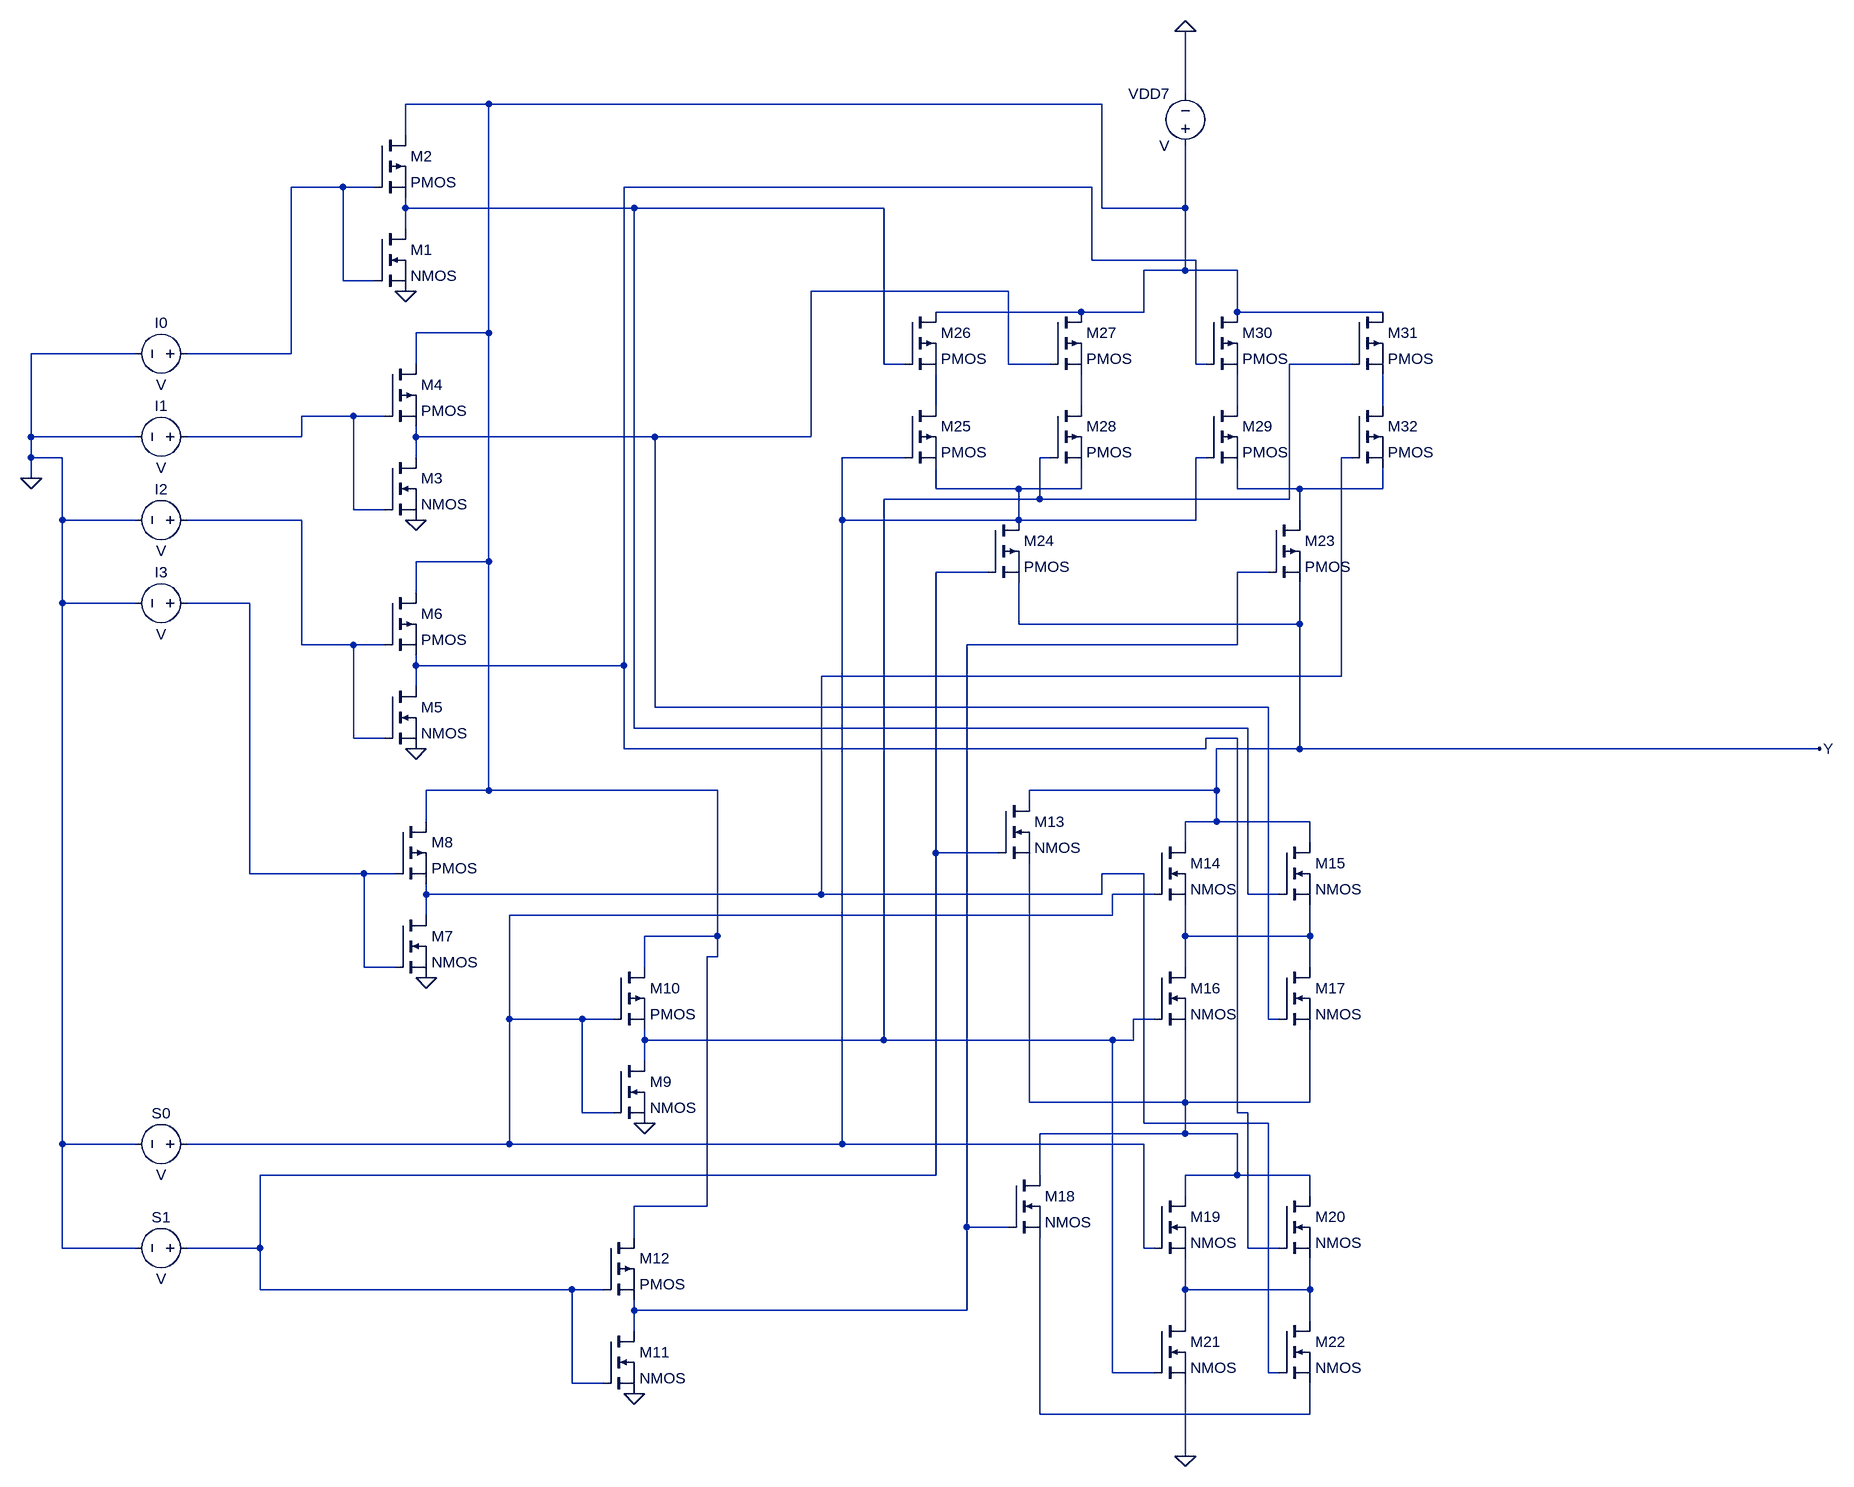
[diagram p0: schematic four to one MUX transistor level Schematic.asc]
four to one MUX transistor level Schematic.asc, the LTspice schematic file:
Version 4.1
SHEET 1 2592 1860
WIRE 1584 -256 1584 -352
WIRE 512 -240 384 -240
WIRE 1456 -240 512 -240
WIRE 384 -192 384 -240
WIRE 288 -112 208 -112
WIRE 336 -112 288 -112
WIRE 1440 -112 720 -112
WIRE 384 -80 384 -96
WIRE 736 -80 384 -80
WIRE 1120 -80 736 -80
WIRE 1456 -80 1456 -240
WIRE 1584 -80 1584 -176
WIRE 1584 -80 1456 -80
WIRE 384 -48 384 -80
WIRE 1440 0 1440 -112
WIRE 1600 0 1440 0
WIRE 1584 16 1584 -80
WIRE 1584 16 1520 16
WIRE 1664 16 1584 16
WIRE 288 32 288 -112
WIRE 336 32 288 32
WIRE 1312 48 1008 48
WIRE 1424 80 1200 80
WIRE 1520 80 1520 16
WIRE 1520 80 1424 80
WIRE 1664 80 1664 16
WIRE 1888 80 1664 80
WIRE 512 112 512 -240
WIRE 512 112 400 112
WIRE -32 144 -192 144
WIRE 208 144 208 -112
WIRE 208 144 48 144
WIRE 400 160 400 112
WIRE 1120 160 1120 -80
WIRE 1152 160 1120 160
WIRE 1312 160 1312 48
WIRE 1376 160 1312 160
WIRE 1600 160 1600 0
WIRE 1616 160 1600 160
WIRE 1840 160 1744 160
WIRE 1200 224 1200 176
WIRE 1424 224 1424 176
WIRE 1664 224 1664 176
WIRE 1888 224 1888 176
WIRE 304 240 224 240
WIRE 352 240 304 240
WIRE -192 272 -192 144
WIRE -32 272 -192 272
WIRE 224 272 224 240
WIRE 224 272 48 272
WIRE 400 272 400 256
WIRE 768 272 400 272
WIRE 1008 272 1008 48
WIRE 1008 272 768 272
WIRE -192 304 -192 272
WIRE -144 304 -192 304
WIRE 400 304 400 272
WIRE 1152 304 1056 304
WIRE 1376 304 1360 304
WIRE 1616 304 1600 304
WIRE 1840 304 1824 304
WIRE -192 336 -192 304
WIRE 1200 352 1200 320
WIRE 1328 352 1200 352
WIRE 1424 352 1424 320
WIRE 1424 352 1328 352
WIRE 1664 352 1664 320
WIRE 1760 352 1664 352
WIRE 1888 352 1888 320
WIRE 1888 352 1760 352
WIRE 1360 368 1360 304
WIRE 1360 368 1120 368
WIRE 1744 368 1744 160
WIRE 1744 368 1360 368
WIRE 304 384 304 240
WIRE 352 384 304 384
WIRE -144 400 -144 304
WIRE -32 400 -144 400
WIRE 224 400 48 400
WIRE 1056 400 1056 304
WIRE 1328 400 1328 352
WIRE 1328 400 1056 400
WIRE 1600 400 1600 304
WIRE 1600 400 1328 400
WIRE 1760 400 1760 352
WIRE 512 464 512 112
WIRE 512 464 400 464
WIRE 1280 480 1200 480
WIRE 1712 480 1664 480
WIRE 400 512 400 464
WIRE -144 528 -144 400
WIRE -32 528 -144 528
WIRE 144 528 48 528
WIRE 1328 560 1328 496
WIRE 1760 560 1760 496
WIRE 1760 560 1328 560
WIRE 224 592 224 400
WIRE 304 592 224 592
WIRE 352 592 304 592
WIRE 1664 592 1664 480
WIRE 1664 592 1248 592
WIRE 400 624 400 608
WIRE 720 624 720 -112
WIRE 720 624 400 624
WIRE 1824 640 1824 304
WIRE 1824 640 1024 640
WIRE 400 656 400 624
WIRE 768 688 768 272
WIRE 1712 688 768 688
WIRE 736 720 736 -80
WIRE 1680 720 736 720
WIRE 304 736 304 592
WIRE 352 736 304 736
WIRE 1664 736 1616 736
WIRE 720 752 720 624
WIRE 1616 752 1616 736
WIRE 1616 752 720 752
WIRE 1760 752 1760 560
WIRE 1760 752 1632 752
WIRE 2560 752 1760 752
WIRE 512 816 512 464
WIRE 512 816 416 816
WIRE 864 816 512 816
WIRE 1632 816 1632 752
WIRE 1632 816 1344 816
WIRE 1344 832 1344 816
WIRE 416 864 416 816
WIRE 1632 864 1632 816
WIRE 1632 864 1584 864
WIRE 1776 864 1632 864
WIRE 1584 896 1584 864
WIRE 1776 896 1776 864
WIRE 1200 912 1200 480
WIRE 1296 912 1200 912
WIRE 144 944 144 528
WIRE 320 944 144 944
WIRE 368 944 320 944
WIRE 1520 944 1456 944
WIRE 416 976 416 960
WIRE 1024 976 1024 640
WIRE 1024 976 416 976
WIRE 1456 976 1456 944
WIRE 1456 976 1024 976
WIRE 1536 976 1472 976
WIRE 1680 976 1680 720
WIRE 1728 976 1680 976
WIRE 416 1008 416 976
WIRE 1472 1008 1472 976
WIRE 1472 1008 544 1008
WIRE 864 1040 864 816
WIRE 864 1040 752 1040
WIRE 1584 1040 1584 992
WIRE 1776 1040 1776 992
WIRE 1776 1040 1584 1040
WIRE 864 1072 864 1040
WIRE 864 1072 848 1072
WIRE 320 1088 320 944
WIRE 368 1088 320 1088
WIRE 752 1088 752 1040
WIRE 1584 1088 1584 1040
WIRE 1776 1088 1776 1040
WIRE 544 1168 544 1008
WIRE 656 1168 544 1168
WIRE 704 1168 656 1168
WIRE 1536 1168 1504 1168
WIRE 1712 1168 1712 688
WIRE 1728 1168 1712 1168
WIRE 752 1200 752 1184
WIRE 1120 1200 1120 368
WIRE 1120 1200 752 1200
WIRE 1472 1200 1120 1200
WIRE 1504 1200 1504 1168
WIRE 1504 1200 1472 1200
WIRE 752 1232 752 1200
WIRE 1344 1296 1344 928
WIRE 1584 1296 1584 1184
WIRE 1584 1296 1344 1296
WIRE 1776 1296 1776 1184
WIRE 1776 1296 1584 1296
WIRE 656 1312 656 1168
WIRE 704 1312 656 1312
WIRE 1664 1312 1664 736
WIRE 1680 1312 1664 1312
WIRE 1520 1328 1520 944
WIRE 1712 1328 1520 1328
WIRE 1584 1344 1584 1296
WIRE 1584 1344 1360 1344
WIRE 1664 1344 1584 1344
WIRE -144 1360 -144 528
WIRE -32 1360 -144 1360
WIRE 544 1360 544 1168
WIRE 544 1360 48 1360
WIRE 1056 1360 1056 400
WIRE 1056 1360 544 1360
WIRE 1520 1360 1056 1360
WIRE 1200 1408 1200 912
WIRE 1200 1408 160 1408
WIRE 1360 1408 1360 1344
WIRE 1664 1408 1664 1344
WIRE 1664 1408 1584 1408
WIRE 1776 1408 1664 1408
WIRE 1584 1440 1584 1408
WIRE 1776 1440 1776 1408
WIRE 848 1456 848 1072
WIRE 848 1456 736 1456
WIRE 1248 1488 1248 592
WIRE 1312 1488 1248 1488
WIRE 736 1504 736 1456
WIRE -144 1520 -144 1360
WIRE -32 1520 -144 1520
WIRE 160 1520 160 1408
WIRE 160 1520 48 1520
WIRE 1520 1520 1520 1360
WIRE 1536 1520 1520 1520
WIRE 1680 1520 1680 1312
WIRE 1728 1520 1680 1520
WIRE 160 1584 160 1520
WIRE 640 1584 160 1584
WIRE 688 1584 640 1584
WIRE 1584 1584 1584 1536
WIRE 1776 1584 1776 1536
WIRE 1776 1584 1584 1584
WIRE 736 1616 736 1600
WIRE 1248 1616 1248 1488
WIRE 1248 1616 736 1616
WIRE 1584 1632 1584 1584
WIRE 1776 1632 1776 1584
WIRE 736 1648 736 1616
WIRE 1472 1712 1472 1200
WIRE 1536 1712 1472 1712
WIRE 1712 1712 1712 1328
WIRE 1728 1712 1712 1712
WIRE 640 1728 640 1584
WIRE 688 1728 640 1728
WIRE 1360 1776 1360 1504
WIRE 1776 1776 1776 1728
WIRE 1776 1776 1360 1776
WIRE 1584 1840 1584 1728
FLAG -192 336 0
FLAG 384 48 0
FLAG 400 400 0
FLAG 400 752 0
FLAG 416 1104 0
FLAG 752 1328 0
FLAG 736 1744 0
FLAG 2560 752 Y
FLAG 1584 1840 0
FLAG 1584 -352 0
SYMBOL voltage 64 144 R90
WINDOW 0 -32 56 VBottom 2
WINDOW 3 32 56 VTop 2
SYMATTR InstName I0
SYMBOL voltage 64 272 R90
WINDOW 0 -32 56 VBottom 2
WINDOW 3 32 56 VTop 2
SYMATTR InstName I1
SYMBOL voltage 64 400 R90
WINDOW 0 -32 56 VBottom 2
WINDOW 3 32 56 VTop 2
SYMATTR InstName I2
SYMBOL voltage 64 528 R90
WINDOW 0 -32 56 VBottom 2
WINDOW 3 32 56 VTop 2
SYMATTR InstName I3
SYMBOL nmos 336 -48 R0
SYMATTR InstName M1
SYMBOL pmos 336 -192 R0
SYMATTR InstName M2
SYMBOL nmos 352 304 R0
SYMATTR InstName M3
SYMBOL pmos 352 160 R0
SYMATTR InstName M4
SYMBOL nmos 352 656 R0
SYMATTR InstName M5
SYMBOL pmos 352 512 R0
SYMATTR InstName M6
SYMBOL nmos 368 1008 R0
SYMATTR InstName M7
SYMBOL pmos 368 864 R0
SYMATTR InstName M8
SYMBOL voltage 64 1360 R90
WINDOW 0 -32 56 VBottom 2
WINDOW 3 32 56 VTop 2
SYMATTR InstName S0
SYMBOL voltage 64 1520 R90
WINDOW 0 -32 56 VBottom 2
WINDOW 3 32 56 VTop 2
SYMATTR InstName S1
SYMBOL nmos 704 1232 R0
SYMATTR InstName M9
SYMBOL pmos 704 1088 R0
SYMATTR InstName M10
SYMBOL nmos 688 1648 R0
SYMATTR InstName M11
SYMBOL pmos 688 1504 R0
SYMATTR InstName M12
SYMBOL nmos 1296 832 R0
SYMATTR InstName M13
SYMBOL nmos 1536 896 R0
SYMATTR InstName M14
SYMBOL nmos 1728 896 R0
SYMATTR InstName M15
SYMBOL nmos 1536 1088 R0
SYMATTR InstName M16
SYMBOL nmos 1728 1088 R0
SYMATTR InstName M17
SYMBOL nmos 1312 1408 R0
SYMATTR InstName M18
SYMBOL nmos 1536 1440 R0
SYMATTR InstName M19
SYMBOL nmos 1728 1440 R0
SYMATTR InstName M20
SYMBOL nmos 1536 1632 R0
SYMATTR InstName M21
SYMBOL nmos 1728 1632 R0
SYMATTR InstName M22
SYMBOL pmos 1712 400 R0
SYMATTR InstName M23
SYMBOL pmos 1280 400 R0
SYMATTR InstName M24
SYMBOL pmos 1152 224 R0
SYMATTR InstName M25
SYMBOL pmos 1152 80 R0
SYMATTR InstName M26
SYMBOL pmos 1376 80 R0
SYMATTR InstName M27
SYMBOL pmos 1376 224 R0
SYMATTR InstName M28
SYMBOL pmos 1616 224 R0
SYMATTR InstName M29
SYMBOL pmos 1616 80 R0
SYMATTR InstName M30
SYMBOL pmos 1840 80 R0
SYMATTR InstName M31
SYMBOL pmos 1840 224 R0
SYMATTR InstName M32
SYMBOL voltage 1584 -160 R180
WINDOW 0 24 96 Left 2
WINDOW 3 24 16 Left 2
SYMATTR InstName VDD7

The netlist it stands for:
* four to one MUX transistor level Schematic.asc
V§I0 N002 0 V
V§I1 N011 0 V
V§I2 N015 0 V
V§I3 N018 0 V
M1 N004 N002 0 0 NMOS
M2 N001 N002 N004 N004 PMOS
M3 N005 N011 0 0 NMOS
M4 N001 N011 N005 N005 PMOS
M5 N003 N015 0 0 NMOS
M6 N001 N015 N003 N003 PMOS
M7 N013 N018 0 0 NMOS
M8 N001 N018 N013 N013 PMOS
V§S0 N012 0 V
V§S1 N016 0 V
M9 N006 N012 0 0 NMOS
M10 N001 N012 N006 N006 PMOS
M11 N017 N016 0 0 NMOS
M12 N001 N016 N017 N017 PMOS
M13 Y N016 N020 N020 NMOS
M14 Y N012 N019 N019 NMOS
M15 Y N004 N019 N019 NMOS
M16 N019 N006 N020 N020 NMOS
M17 N019 N005 N020 N020 NMOS
M18 N020 N017 N022 N022 NMOS
M19 N020 N012 N021 N021 NMOS
M20 N020 N003 N021 N021 NMOS
M21 N021 N006 0 0 NMOS
M22 N021 N013 N022 N022 NMOS
M23 N014 N017 Y Y PMOS
M24 N012 N016 Y Y PMOS
M25 N007 N012 N012 N012 PMOS
M26 N001 N004 N007 N007 PMOS
M27 N001 N005 N008 N008 PMOS
M28 N008 N006 N012 N012 PMOS
M29 N009 N012 N014 N014 PMOS
M30 N001 N003 N009 N009 PMOS
M31 N001 N006 N010 N010 PMOS
M32 N010 N013 N014 N014 PMOS
VDD7 N001 0 V
.model NMOS NMOS
.model PMOS PMOS
.lib standard.mos
.backanno
.end